# EAGLE design LED-Lamp-pth-v3 (EAGLE 7.6.0)
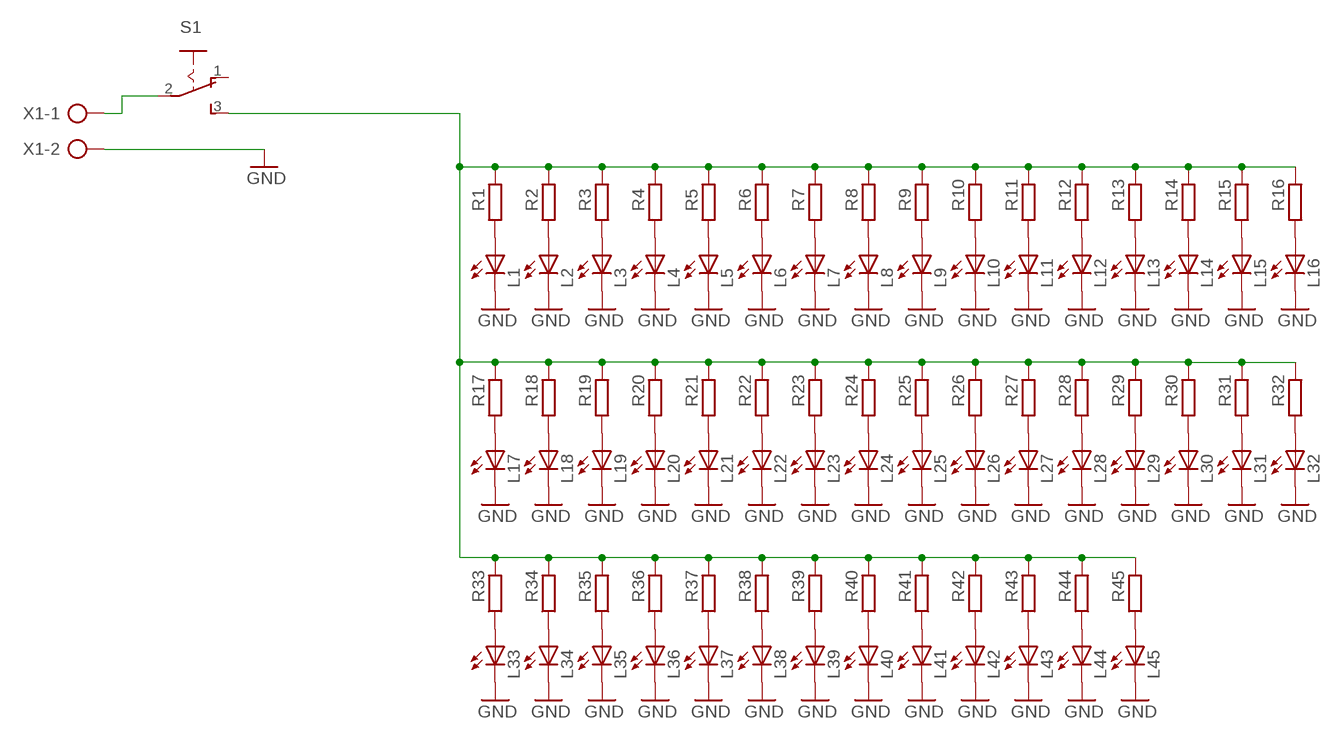
[diagram p0: schematic, sheet 1]

## Parts
L1  LEDCHIP-LED0805  [CHIP-LED0805]
L2  LEDCHIP-LED0805  [CHIP-LED0805]
L3  LEDCHIP-LED0805  [CHIP-LED0805]
L4  LEDCHIP-LED0805  [CHIP-LED0805]
L5  LEDCHIP-LED0805  [CHIP-LED0805]
L6  LEDCHIP-LED0805  [CHIP-LED0805]
L7  LEDCHIP-LED0805  [CHIP-LED0805]
L8  LEDCHIP-LED0805  [CHIP-LED0805]
L9  LEDCHIP-LED0805  [CHIP-LED0805]
L10  LEDCHIP-LED0805  [CHIP-LED0805]
L11  LEDCHIP-LED0805  [CHIP-LED0805]
L12  LEDCHIP-LED0805  [CHIP-LED0805]
L13  LEDCHIP-LED0805  [CHIP-LED0805]
L14  LEDCHIP-LED0805  [CHIP-LED0805]
L15  LEDCHIP-LED0805  [CHIP-LED0805]
L16  LEDCHIP-LED0805  [CHIP-LED0805]
L17  LEDCHIP-LED0805  [CHIP-LED0805]
L18  LEDCHIP-LED0805  [CHIP-LED0805]
L19  LEDCHIP-LED0805  [CHIP-LED0805]
L20  LEDCHIP-LED0805  [CHIP-LED0805]
L21  LEDCHIP-LED0805  [CHIP-LED0805]
L22  LEDCHIP-LED0805  [CHIP-LED0805]
L23  LEDCHIP-LED0805  [CHIP-LED0805]
L24  LEDCHIP-LED0805  [CHIP-LED0805]
L25  LEDCHIP-LED0805  [CHIP-LED0805]
L26  LEDCHIP-LED0805  [CHIP-LED0805]
L27  LEDCHIP-LED0805  [CHIP-LED0805]
L28  LEDCHIP-LED0805  [CHIP-LED0805]
L29  LEDCHIP-LED0805  [CHIP-LED0805]
L30  LEDCHIP-LED0805  [CHIP-LED0805]
L31  LEDCHIP-LED0805  [CHIP-LED0805]
L32  LEDCHIP-LED0805  [CHIP-LED0805]
L33  LEDCHIP-LED0805  [CHIP-LED0805]
L34  LEDCHIP-LED0805  [CHIP-LED0805]
L35  LEDCHIP-LED0805  [CHIP-LED0805]
L36  LEDCHIP-LED0805  [CHIP-LED0805]
L37  LEDCHIP-LED0805  [CHIP-LED0805]
L38  LEDCHIP-LED0805  [CHIP-LED0805]
L39  LEDCHIP-LED0805  [CHIP-LED0805]
L40  LEDCHIP-LED0805  [CHIP-LED0805]
L41  LEDCHIP-LED0805  [CHIP-LED0805]
L42  LEDCHIP-LED0805  [CHIP-LED0805]
L43  LEDCHIP-LED0805  [CHIP-LED0805]
L44  LEDCHIP-LED0805  [CHIP-LED0805]
L45  LEDCHIP-LED0805  [CHIP-LED0805]
R1  R-EU_0207/7  [0207/7]
R2  R-EU_0207/7  [0207/7]
R3  R-EU_0207/7  [0207/7]
R4  R-EU_0207/7  [0207/7]
R5  R-EU_0207/7  [0207/7]
R6  R-EU_0207/7  [0207/7]
R7  R-EU_0207/7  [0207/7]
R8  R-EU_0207/7  [0207/7]
R9  R-EU_0207/7  [0207/7]
R10  R-EU_0207/7  [0207/7]
R11  R-EU_0207/7  [0207/7]
R12  R-EU_0207/7  [0207/7]
R13  R-EU_0207/7  [0207/7]
R14  R-EU_0207/7  [0207/7]
R15  R-EU_0207/7  [0207/7]
R16  R-EU_0207/7  [0207/7]
R17  R-EU_0207/7  [0207/7]
R18  R-EU_0207/7  [0207/7]
R19  R-EU_0207/7  [0207/7]
R20  R-EU_0207/7  [0207/7]
R21  R-EU_0207/7  [0207/7]
R22  R-EU_0207/7  [0207/7]
R23  R-EU_0207/7  [0207/7]
R24  R-EU_0207/7  [0207/7]
R25  R-EU_0207/7  [0207/7]
R26  R-EU_0207/7  [0207/7]
R27  R-EU_0207/7  [0207/7]
R28  R-EU_0207/7  [0207/7]
R29  R-EU_0207/7  [0207/7]
R30  R-EU_0207/7  [0207/7]
R31  R-EU_0207/7  [0207/7]
R32  R-EU_0207/7  [0207/7]
R33  R-EU_0207/7  [0207/7]
R34  R-EU_0207/7  [0207/7]
R35  R-EU_0207/7  [0207/7]
R36  R-EU_0207/7  [0207/7]
R37  R-EU_0207/7  [0207/7]
R38  R-EU_0207/7  [0207/7]
R39  R-EU_0207/7  [0207/7]
R40  R-EU_0207/7  [0207/7]
R41  R-EU_0207/7  [0207/7]
R42  R-EU_0207/7  [0207/7]
R43  R-EU_0207/7  [0207/7]
R44  R-EU_0207/7  [0207/7]
R45  R-EU_0207/7  [0207/7]
S1  255SB  [255SB]
X1  AK300/2  [AK300/2]

## Nets
GND: L1.C L2.C L3.C L4.C L5.C L6.C L7.C L8.C L9.C L10.C L11.C L12.C L13.C L14.C L15.C L16.C L17.C L18.C L19.C L20.C L21.C L22.C L23.C L24.C L25.C L26.C L27.C L28.C L29.C L30.C L31.C L32.C L33.C L34.C L35.C L36.C L37.C L38.C L39.C L40.C L41.C L42.C L43.C L44.C L45.C X1.2
N$1: L2.A R2.1
N$2: L3.A R3.1
N$3: L4.A R4.1
N$4: L5.A R5.1
N$5: L6.A R6.1
N$6: L7.A R7.1
N$7: L8.A R8.1
N$8: L9.A R9.1
N$9: L10.A R10.1
N$10: L11.A R11.1
N$11: L12.A R12.1
N$12: L13.A R13.1
N$13: L14.A R14.1
N$14: L15.A R15.1
N$15: L16.A R16.1
N$16: L17.A R17.1
N$17: L18.A R18.1
N$18: L19.A R19.1
N$19: L20.A R20.1
N$20: L21.A R21.1
N$21: L22.A R22.1
N$22: L23.A R23.1
N$23: L24.A R24.1
N$24: L25.A R25.1
N$25: L26.A R26.1
N$26: L27.A R27.1
N$27: S1.2(P) X1.1
N$28: L28.A R28.1
N$29: L31.A R31.1
N$30: L29.A R29.1
N$31: L1.A R1.1
N$32: L30.A R30.1
N$33: L32.A R32.1
N$35: L33.A R33.1
N$36: L34.A R34.1
N$37: L35.A R35.1
N$38: L36.A R36.1
N$39: L37.A R37.1
N$40: L38.A R38.1
N$41: L39.A R39.1
N$42: L40.A R40.1
N$43: L41.A R41.1
N$44: L42.A R42.1
N$45: L43.A R43.1
N$46: L44.A R44.1
N$47: L45.A R45.1
N$48: R1.2 R2.2 R3.2 R4.2 R5.2 R6.2 R7.2 R8.2 R9.2 R10.2 R11.2 R12.2 R13.2 R14.2 R15.2 R16.2 R17.2 R18.2 R19.2 R20.2 R21.2 R22.2 R23.2 R24.2 R25.2 R26.2 R27.2 R28.2 R29.2 R30.2 R31.2 R32.2 R33.2 R34.2 R35.2 R36.2 R37.2 R38.2 R39.2 R40.2 R41.2 R42.2 R43.2 R44.2 R45.2 S1.3(S)
Unconnected: S1.1(O)

## Library data of the parts
L1-L45 = led:LED: LED OSRAM: - CHIPLED LG R971, LG N971, LY N971, LG Q971, LY Q971, LO R971, LY R971 LH N974, LH R974 LS Q976, LO Q976, LY Q976 LO Q996 - Hyper CHIPLED LW Q18S LB Q993, LB Q99A, LB R99A - SideLED LS A670, LO A670, LY A670, LG A670, LP A670 LB A673, LV A673, LT A673, LW A673 LH A674 LY A675 LS A676, LA A676, LO A676, LY A676, LW A676 LS A679, LY A679, LG A679 - Hyper Micro SIDELED® LS Y876, LA Y876, LO Y876, LY Y876 LT Y87S - SmartLED LW L88C, LW L88S LB L89C, LB L89S, LG L890 LS L89K, LO L89K, LY L89K LS L896, LA L896, LO L896, LY L896 - TOPLED LS T670, LO T670, LY T670, LG T670, LP T670 LSG T670, LSP T670, LSY T670, LOP T670, LYG T670 LG T671, LOG T671, LSG T671 LB T673, LV T673, LT T673, LW T673 LH T674 LS T676, LA T676, LO T676, LY T676, LB T676, LH T676, LSB T676, LW T676 LB T67C, LV T67C, LT T67C, LS T67K, LO T67K, LY T67K, LW E67C LS E67B, LA E67B, LO E67B, LY E67B, LB E67C, LV E67C, LT E67C LW T67C LS T679, LY T679, LG T679 LS T770, LO T770, LY T770, LG T770, LP T770 LB T773, LV T773, LT T773, LW T773 LH T774 LS E675, LA E675, LY E675, LS T675 LS T776, LA T776, LO T776, LY T776, LB T776 LHGB T686 LT T68C, LB T68C - Hyper Mini TOPLED® LB M676 - Mini TOPLED Santana® LG M470 LS M47K, LO M47K, LY M47K Source: http://www.osram.convergy.de LUXEON: - LUMILED® LXK2-PW12-R00, LXK2-PW12-S00, LXK2-PW14-U00, LXK2-PW14-V00 LXK2-PM12-R00, LXK2-PM12-S00, LXK2-PM14-U00 LXK2-PE12-Q00, LXK2-PE12-R00, LXK2-PE12-S00, LXK2-PE14-T00, LXK2-PE14-U00 LXK2-PB12-K00, LXK2-PB12-L00, LXK2-PB12-M00, LXK2-PB14-N00, LXK2-PB14-P00, LXK2-PB14-Q00 LXK2-PR12-L00, LXK2-PR12-M00, LXK2-PR14-Q00, LXK2-PR14-R00 LXK2-PD12-Q00, LXK2-PD12-R00, LXK2-PD12-S00 LXK2-PH12-R00, LXK2-PH12-S00 LXK2-PL12-P00, LXK2-PL12-Q00, LXK2-PL12-R00 Source: www.luxeon.com KINGBRIGHT: KA-3528ASYC Source: www.kingbright.com
R1-R45 = rcl:R-EU_: RESISTOR, European symbol
S1 = switch:255SB: SLIDING SWITCH Distributor Buerklin, 11G810
X1 = con-ptr500:AK300/2: CONNECTOR; OC_FARNELL: unknown; OC_NEWARK: unknown

## Board
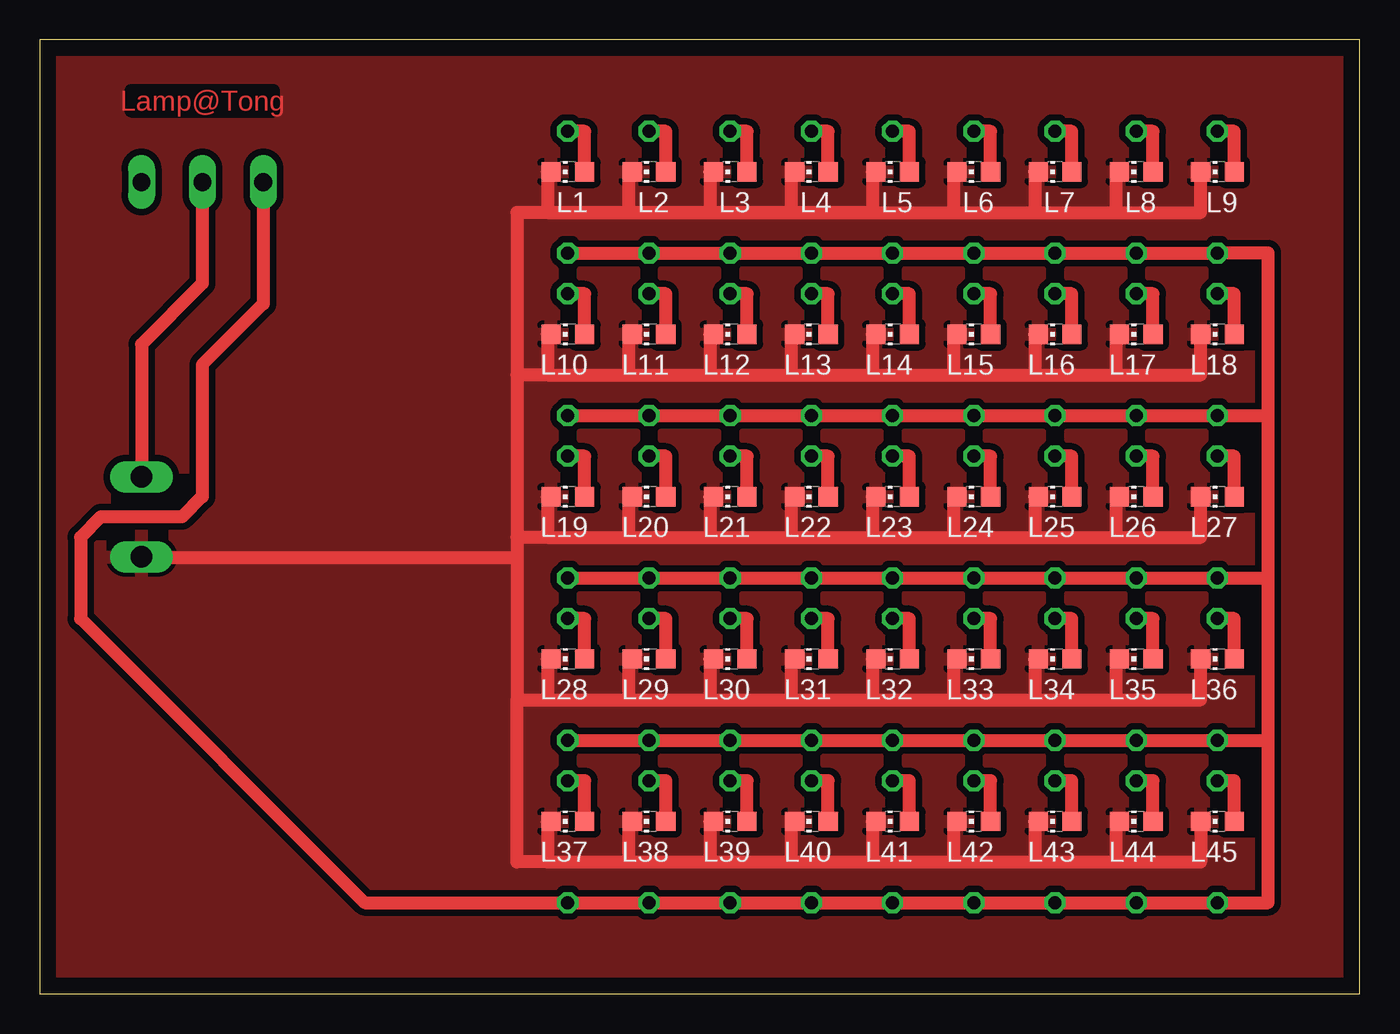
[diagram p1: board, top side]
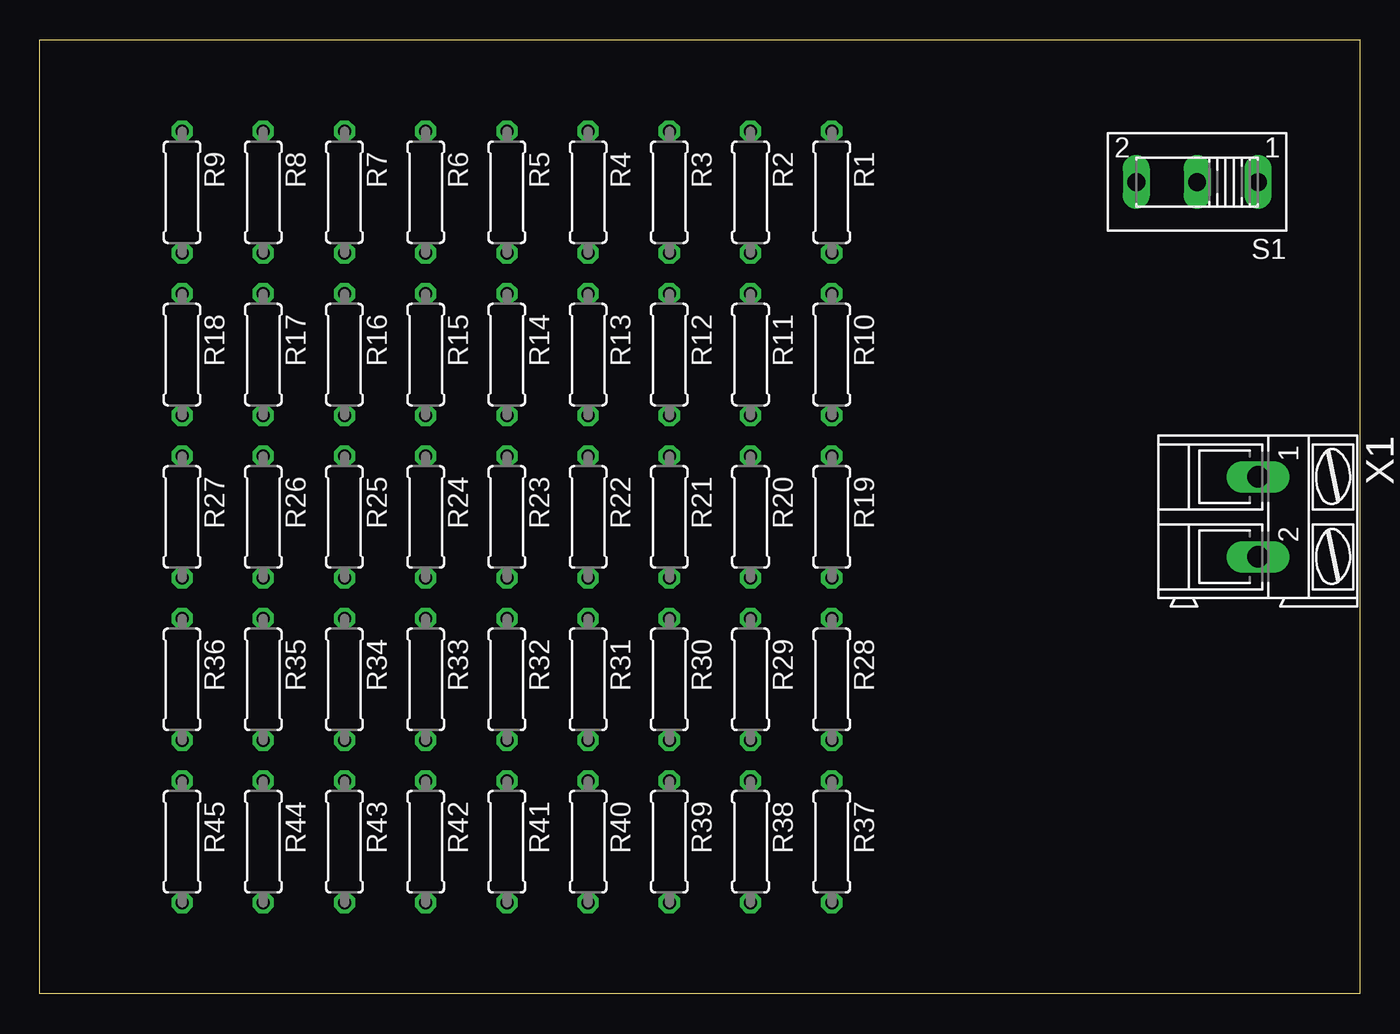
[diagram p2: board, bottom side, seen from below]

Size 82.55 x 59.69 mm. Coordinates in mm from the lower left corner, seen from the top.
Outline: 0,0 82.55,0 82.55,59.69 0,59.69 0,0
Copper layers (1*16): Top 0.035mm / dielectric 1.5mm / Bottom 0.035mm
Design rules "default": minimum track width 10mil, minimum drill 24mil, track to track 8mil, track to pad 8mil, pad to pad 8mil, via to via 8mil, smd to smd 8mil, copper to edge 40mil, drill to drill 8mil, minimum pad ring 10mil, minimum via ring 8mil, stop-mask expansion 4mil, vias tented up to drill 0mil, thermal gap 10mil

### Footprints (pad centres in the part's own frame; a part is rotated, then mirrored left to right if it is on the bottom)
CHIP-LED0805 = smd 1.2 x 1.2: A 0,-1.05; C 0,1.05
0207/7 = drill 0.813 octagon: 1 -3.81,0; 2 3.81,0
255SB = drill 1.118 long: 1 -3.81,0; 2 0,0; 3 3.81,0
AK300/2 = drill 1.321 long: 1 -2.515,0; 2 2.489,0

### Placement (x,y rotation side)
L1  33.02,51.44 90 top
L2  38.1,51.44 90 top
L3  43.18,51.44 90 top
L4  48.26,51.44 90 top
L5  53.34,51.44 90 top
L6  58.42,51.44 90 top
L7  63.5,51.44 90 top
L8  68.58,51.44 90 top
L9  73.66,51.44 90 top
L10  33.02,41.27 90 top
L11  38.1,41.27 90 top
L12  43.18,41.27 90 top
L13  48.26,41.27 90 top
L14  53.34,41.27 90 top
L15  58.42,41.27 90 top
L16  63.5,41.27 90 top
L17  68.58,41.27 90 top
L18  73.66,41.27 90 top
L19  33.02,31.11 90 top
L20  38.1,31.11 90 top
L21  43.18,31.11 90 top
L22  48.26,31.11 90 top
L23  53.34,31.11 90 top
L24  58.42,31.11 90 top
L25  63.5,31.11 90 top
L26  68.58,31.11 90 top
L27  73.66,31.11 90 top
L28  33.02,20.95 90 top
L29  38.1,20.95 90 top
L30  43.18,20.95 90 top
L31  48.26,20.95 90 top
L32  53.34,20.95 90 top
L33  58.42,20.95 90 top
L34  63.5,20.95 90 top
L35  68.58,20.95 90 top
L36  73.66,20.95 90 top
L37  33.02,10.79 90 top
L38  38.1,10.79 90 top
L39  43.18,10.79 90 top
L40  48.26,10.79 90 top
L41  53.34,10.79 90 top
L42  58.42,10.79 90 top
L43  63.5,10.79 90 top
L44  68.58,10.79 90 top
L45  73.66,10.79 90 top
R1  33.02,50.16 270 bottom
R2  38.1,50.16 270 bottom
R3  43.18,50.16 270 bottom
R4  48.26,50.16 270 bottom
R5  53.34,50.16 270 bottom
R6  58.42,50.16 270 bottom
R7  63.5,50.16 270 bottom
R8  68.58,50.16 270 bottom
R9  73.66,50.16 270 bottom
R10  33.02,40.01 270 bottom
R11  38.1,40.01 270 bottom
R12  43.18,40.01 270 bottom
R13  48.26,40.01 270 bottom
R14  53.34,40.01 270 bottom
R15  58.42,40.01 270 bottom
R16  63.5,40.01 270 bottom
R17  68.58,40.01 270 bottom
R18  73.66,40.01 270 bottom
R19  33.02,29.84 270 bottom
R20  38.1,29.84 270 bottom
R21  43.18,29.84 270 bottom
R22  48.26,29.84 270 bottom
R23  53.34,29.84 270 bottom
R24  58.42,29.84 270 bottom
R25  63.5,29.84 270 bottom
R26  68.58,29.84 270 bottom
R27  73.66,29.84 270 bottom
R28  33.02,19.68 270 bottom
R29  38.1,19.68 270 bottom
R30  43.18,19.68 270 bottom
R31  48.26,19.68 270 bottom
R32  53.34,19.68 270 bottom
R33  58.42,19.68 270 bottom
R34  63.5,19.68 270 bottom
R35  68.58,19.68 270 bottom
R36  73.66,19.68 270 bottom
R37  33.02,9.53 270 bottom
R38  38.1,9.53 270 bottom
R39  43.18,9.53 270 bottom
R40  48.26,9.53 270 bottom
R41  53.34,9.53 270 bottom
R42  58.42,9.53 270 bottom
R43  63.5,9.53 270 bottom
R44  68.58,9.53 270 bottom
R45  73.66,9.53 270 bottom
S1  10.16,50.8 180 bottom
X1  6.35,29.84 270 bottom

### Tracks (layer width: path | path; a pad name or v marks a point on that pad's centre or on a via)
GND
  Top 0.813: L1.C 31.75,51.44 31.75,48.9 36.83,48.9 | 36.83,48.9 41.91,48.9 | 41.91,48.9 46.99,48.9 | 46.99,48.9 52.07,48.9 | 52.07,48.9 57.15,48.9 | 57.15,48.9 62.23,48.9 | 62.23,48.9 67.31,48.9 | 67.31,48.9 72.61,48.9 L9.C | L2.C 36.83,51.44 36.83,48.9 | L3.C 41.91,51.44 41.91,48.9 | L4.C 46.99,51.44 46.99,48.9 | L5.C 52.07,51.44 52.07,48.9 | L6.C 57.15,51.44 57.15,48.9 | L7.C 62.23,51.44 62.23,48.9 | L8.C 67.31,51.44 67.31,48.9 | L10.C 31.75,41.27 31.75,38.73 | 31.75,38.73 36.83,38.73 | 36.83,38.73 41.91,38.73 | 41.91,38.73 46.99,38.73 | 46.99,38.73 52.07,38.73 | 52.07,38.73 57.15,38.73 | 57.15,38.73 62.23,38.73 | 62.23,38.73 67.31,38.73 | 67.31,38.73 72.61,38.73 L18.C | L11.C 36.83,41.27 36.83,38.73 | L12.C 41.91,41.27 41.91,38.73 | L13.C 46.99,41.27 46.99,38.73 | L14.C 52.07,41.27 52.07,38.73 | L15.C 57.15,41.27 57.15,38.73 | L16.C 62.23,41.27 62.23,38.73 | L17.C 67.31,41.27 67.31,38.73 | L19.C 31.75,31.11 31.75,28.57 | 31.75,28.57 36.83,28.57 | 36.83,28.57 41.91,28.57 | 41.91,28.57 46.99,28.57 | 46.99,28.57 52.07,28.57 | 52.07,28.57 57.15,28.57 | 57.15,28.57 62.23,28.57 | 62.23,28.57 67.31,28.57 | 67.31,28.57 72.61,28.57 L27.C | L28.C 31.75,20.95 31.75,18.41 | 31.75,18.41 36.83,18.41 | 36.83,18.41 41.91,18.41 | 41.91,18.41 46.99,18.41 | 46.99,18.41 52.07,18.41 | 52.07,18.41 57.15,18.41 | 57.15,18.41 62.23,18.41 | 62.23,18.41 67.31,18.41 | 67.31,18.41 72.61,18.41 L36.C | L20.C 36.83,31.11 36.83,28.57 | L21.C 41.91,31.11 41.91,28.57 | L22.C 46.99,31.11 46.99,28.57 | L23.C 52.07,31.11 52.07,28.57 | L24.C 57.15,31.11 57.15,28.57 | L25.C 62.23,31.11 62.23,28.57 | L26.C 67.31,31.11 67.31,28.57 | L29.C 36.83,20.95 36.83,18.41 | L30.C 41.91,20.95 41.91,18.41 | L31.C 46.99,20.95 46.99,18.41
  Top 0.813: L32.C 52.07,20.95 52.07,18.41 | L33.C 57.15,20.95 57.15,18.41 | L34.C 62.23,20.95 62.23,18.41 | L35.C 67.31,20.95 67.31,18.41 | L37.C 31.75,10.79 31.75,8.26 | 31.75,8.26 36.83,8.26 | 36.83,8.26 41.91,8.26 | 41.91,8.26 46.99,8.26 | 46.99,8.26 52.07,8.26 | 52.07,8.26 57.15,8.26 | 57.15,8.26 62.23,8.26 | 62.23,8.26 67.31,8.26 | 67.31,8.26 72.61,8.26 L45.C | L38.C 36.83,10.79 36.83,8.26 | L39.C 41.91,10.79 41.91,8.26 | L40.C 46.99,10.79 46.99,8.26 | L41.C 52.07,10.79 52.07,8.26 | L42.C 57.15,10.79 57.15,8.26 | L43.C 62.23,10.79 62.23,8.26 | L44.C 67.31,10.79 67.31,8.26 | 31.75,8.26 29.84,8.26 29.84,18.41 | 29.84,18.41 31.75,18.41 | 31.75,28.57 29.84,28.57 | 29.84,28.57 29.84,27.3 | 29.84,27.3 29.84,18.41 | 31.75,38.73 29.84,38.73 | 29.84,38.73 29.84,28.57 | 52.07,48.9 29.84,48.9 29.84,38.73 | X1.2 6.35,27.3 29.84,27.3
  pour Top (isolate 0.406): 0,0 82.55,0 82.55,59.69 0,59.69
N$1
  Top 0.813: L2.A 39.15,53.98 R2.1
N$2
  Top 0.813: L3.A 44.23,53.98 R3.1
N$3
  Top 0.813: L4.A 49.31,53.98 R4.1
N$4
  Top 0.813: L5.A 54.39,53.98 R5.1
N$5
  Top 0.813: L6.A 59.47,53.98 R6.1
N$6
  Top 0.813: L7.A 64.55,53.98 R7.1
N$7
  Top 0.813: L8.A 69.63,53.98 R8.1
N$8
  Top 0.813: L9.A 74.71,53.98 R9.1
N$9
  Top 0.813: L10.A 34.07,43.81 R10.1
N$10
  Top 0.813: L11.A 39.15,43.81 R11.1
N$11
  Top 0.813: L12.A 44.23,43.81 R12.1
N$12
  Top 0.813: L13.A 49.31,43.81 R13.1
N$13
  Top 0.813: L14.A 54.39,43.81 R14.1
N$14
  Top 0.813: L15.A 59.47,43.81 R15.1
N$15
  Top 0.813: L16.A 64.55,43.81 R16.1
N$16
  Top 0.813: L17.A 69.63,43.81 R17.1
N$17
  Top 0.813: L18.A 74.71,43.81 R18.1
N$18
  Top 0.813: L19.A 34.07,33.66 R19.1
N$19
  Top 0.813: L20.A 39.15,33.66 R20.1
N$20
  Top 0.813: L21.A 44.23,33.66 R21.1
N$21
  Top 0.813: L22.A 49.31,33.66 R22.1
N$22
  Top 0.813: L23.A 54.39,33.66 R23.1
N$23
  Top 0.813: L24.A 59.47,33.66 R24.1
N$24
  Top 0.813: L25.A 64.55,33.66 R25.1
N$25
  Top 0.813: L26.A 69.63,33.66 R26.1
N$26
  Top 0.813: L27.A 74.71,33.66 R27.1
N$27
  Top 0.813: S1.2 10.16,44.45 6.35,40.64 X1.1
N$28
  Top 0.813: L28.A 34.07,23.5 R28.1
N$29
  Top 0.813: L31.A 49.31,23.5 R31.1
N$30
  Top 0.813: L29.A 39.15,23.5 R29.1
N$31
  Top 0.813: L1.A 34.07,53.98 R1.1
N$32
  Top 0.813: L30.A 44.23,23.5 R30.1
N$33
  Top 0.813: L32.A 54.39,23.5 R32.1
N$35
  Top 0.813: L33.A 59.47,23.5 R33.1
N$36
  Top 0.813: L34.A 64.55,23.5 R34.1
N$37
  Top 0.813: L35.A 69.63,23.5 R35.1
N$38
  Top 0.813: L36.A 74.71,23.5 R36.1
N$39
  Top 0.813: L37.A 34.07,13.34 R37.1
N$40
  Top 0.813: L38.A 39.15,13.34 R38.1
N$41
  Top 0.813: L39.A 44.23,13.34 R39.1
N$42
  Top 0.813: L40.A 49.31,13.34 R40.1
N$43
  Top 0.813: L41.A 54.39,13.34 R41.1
N$44
  Top 0.813: L42.A 59.47,13.34 R42.1
N$45
  Top 0.813: L43.A 64.55,13.34 R43.1
N$46
  Top 0.813: L44.A 69.63,13.34 R44.1
N$47
  Top 0.813: L45.A 74.71,13.34 R45.1
N$48
  Top 0.813: R1.2 R2.2 R3.2 R4.2 R5.2 R6.2 R7.2 R8.2 R9.2 76.83,46.35 76.83,36.2 | R10.2 R11.2 R12.2 R13.2 R14.2 R15.2 R16.2 R17.2 R18.2 76.83,36.2 | R19.2 R20.2 R21.2 R22.2 R23.2 R24.2 R25.2 R26.2 R27.2 76.83,26.04 | R28.2 R29.2 R30.2 R31.2 R32.2 R33.2 R34.2 R35.2 R36.2 76.83,15.88 | 76.83,26.04 76.83,36.2 | 76.83,15.88 76.83,5.71 R45.2 R44.2 R43.2 R42.2 R41.2 R40.2 R39.2 R38.2 R37.2 20.32,5.71 2.54,23.5 2.54,28.57 3.81,29.84 8.89,29.84 10.16,31.11 10.16,39.37 13.97,43.18 S1.3 | 76.83,15.88 76.83,26.04

### Text on the board
Top: Lamp@Tong